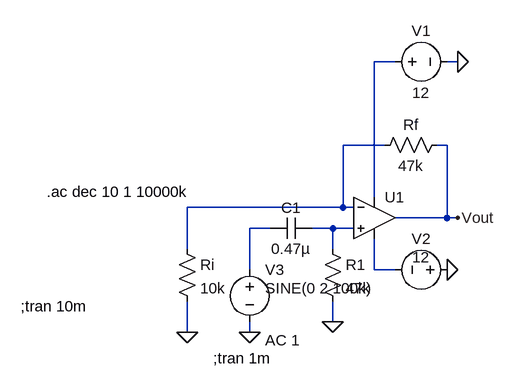
[diagram p0: schematic non-inverting-amplifier.asc]
non-inverting-amplifier.asc, the LTspice schematic file:
Version 4
SHEET 1 880 680
WIRE 240 -80 208 -80
WIRE 336 -80 320 -80
WIRE 224 48 160 48
WIRE 320 48 304 48
WIRE 208 128 208 -80
WIRE 160 144 160 48
WIRE 160 144 -80 144
WIRE 176 144 160 144
WIRE 320 160 320 48
WIRE 320 160 240 160
WIRE 336 160 320 160
WIRE 48 176 16 176
WIRE 144 176 112 176
WIRE 176 176 144 176
WIRE -80 208 -80 144
WIRE 144 208 144 176
WIRE 16 240 16 176
WIRE 208 240 208 192
WIRE 240 240 208 240
WIRE 144 320 144 288
WIRE -80 336 -80 288
WIRE 16 336 16 320
FLAG 320 240 0
FLAG 336 -80 0
FLAG 336 160 Vout
FLAG 144 320 0
FLAG 16 336 0
FLAG -80 336 0
SYMBOL voltage 336 240 R90
WINDOW 0 -32 56 VBottom 2
WINDOW 3 -4 56 VBottom 2
WINDOW 123 0 0 Left 0
WINDOW 39 0 0 Left 0
SYMATTR InstName V2
SYMATTR Value 12
SYMBOL OpAmps\\UniversalOpamp 208 160 R0
SYMATTR InstName U1
SYMBOL res 320 32 R90
WINDOW 0 0 56 VBottom 2
WINDOW 3 32 56 VTop 2
SYMATTR InstName Rf
SYMATTR Value 47k
SYMBOL voltage 224 -80 R270
WINDOW 0 32 56 VTop 2
WINDOW 3 -32 56 VBottom 2
WINDOW 123 0 0 Left 0
WINDOW 39 0 0 Left 0
SYMATTR InstName V1
SYMATTR Value 12
SYMBOL res 128 192 R0
SYMATTR InstName R1
SYMATTR Value 47k
SYMBOL cap 112 160 R90
WINDOW 0 0 32 VBottom 2
WINDOW 3 32 32 VTop 2
SYMATTR InstName C1
SYMATTR Value 0.47µ
SYMBOL voltage 16 224 R0
WINDOW 123 24 124 Left 2
WINDOW 39 0 0 Left 0
WINDOW 3 24 44 Left 2
SYMATTR Value2 AC 1
SYMATTR Value SINE(0 2 100k)
SYMATTR InstName V3
SYMBOL res -96 192 R0
SYMATTR InstName Ri
SYMATTR Value 10k
TEXT -40 376 Left 2 !;tran 1m
TEXT -336 296 Left 2 !;tran 10m
TEXT -296 120 Left 2 !.ac dec 10 1 10000k

The netlist it stands for:
* non-inverting-amplifier.asc
V2 0 N005 12
XU1 N004 N002 N001 N005 Vout level1 Avol=1Meg GBW=10Meg Vos=0 En=0 Enk=0 In=0 Ink=0 Rin=500Meg  ; pins In+ In- V+ V- OUT
Rf Vout N002 47k
V1 N001 0 12
R1 N004 0 47k
C1 N004 N003 0.47µ
V3 N003 0 SINE(0 2 100k) AC 1
Ri N002 0 10k
;tran 1m
;tran 10m
.ac dec 10 1 10000k
.lib UniversalOpAmp1.lib
.backanno
.end